# Altium schematic sheet Parallel LED Strip Buck Converter.SchDoc
size A; SheetNumber: 3; SheetTotal: 19
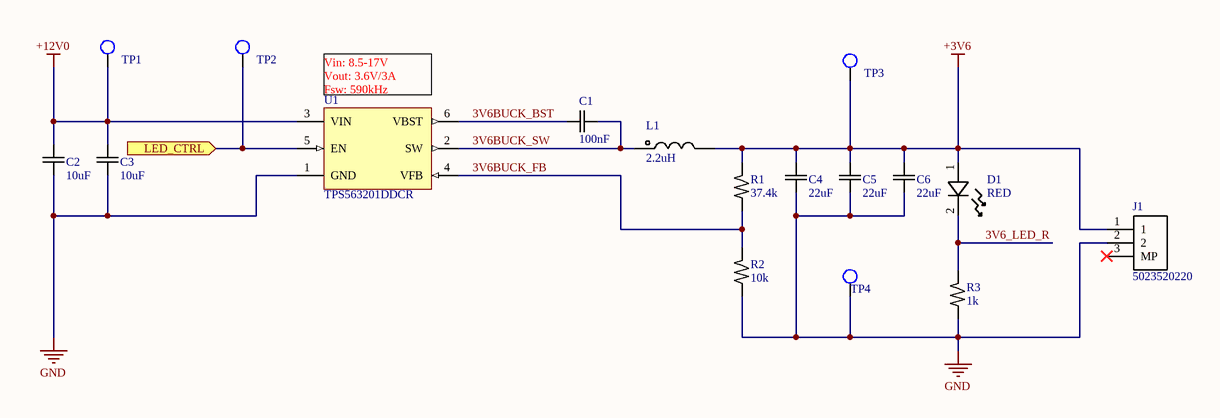
[diagram p0: Parallel LED Strip Buck Converter.SchDoc]

## Parts
C1  100nF  [C0603]
C2  10uF  [C1206]
C3  10uF  [C1206]
C4  22uF  [C1206]
C5  22uF  [C1206]
C6  22uF  [C1206]
D1  RED  [LED0805 RED]
J1  5023520220  [5600200220]
L1  2.2uH  [Coil 7.2x6.6]
R1  37.4k  [R0603]
R2  10k  [R0603]
R3  1k  [R0603]
TP1  TestPoint  [TESTPOINT_SMD_1.27MM]  (value not drawn)  (no BOM)
TP2  TestPoint  [TESTPOINT_SMD_1.27MM]  (value not drawn)  (no BOM)
TP3  TestPoint  [TESTPOINT_SMD_1.27MM]  (value not drawn)  (no BOM)
TP4  TestPoint  [TESTPOINT_SMD_1.27MM]  (value not drawn)  (no BOM)
U1  TPS563201DDCR  [SOT23-6]

## Ports
LED_CTRL (in)

## Nets
+3V6: C4.1 C5.1 C6.1 D1.1 J1.1 L1.2 R1.2 TP3.1
+12V0: C2.2 C3.2 TP1.1 U1.3(VIN)
GND: C2.1 C3.1 C4.2 C5.2 C6.2 J1.2 R2.1 R3.1 TP4.1 U1.1(GND)
3V6_LED_R: D1.2 R3.2
3V6BUCK_BST: C1.1 U1.6(VBST)
3V6BUCK_FB: R1.1 R2.2 U1.4(VFB)
3V6BUCK_SW: C1.2 L1.1 U1.2(SW)
LED_CTRL: TP2.1 U1.5(EN) ; port LED_CTRL

Not connected (* = marked no-connect by the designer): J1 3(MP)*

## Notes on the sheet
- (near U1) Vin: 8.5-17V
  Vout: 3.6V/3A
  Fsw: 590kHz
- Project:
- Sheet Title:
- Size
- Date:
- A
- Sheet Number:
- Sheet Total:
- Revision:
- Time:
- Author:

## Library data of the parts
C1 = Cap_cer: CAP CER 100nF 50V X7R 0603; MF: HRE; MP: CGA0603X7R104K500JT; ComponentLink1Description: Datasheet; ComponentLink1URL: https://www.lcsc.com/datasheet/C6119867.pdf; ComponentLink2Description: Supplier1; ComponentLink2URL: https://www.lcsc.com/product-detail/C6119867.html
C2 C3 = Cap_cer: CAP CER 10uF 25V X7R 1206; MF: SAMWHA; MP: CS3216X7R106K250NRI; ComponentLink1Description: Datasheet; ComponentLink1URL: https://www.lcsc.com/datasheet/C513767.pdf; ComponentLink2Description: Supplier1; ComponentLink2URL: https://www.lcsc.com/product-detail/C513767.html
C4-C6 = Cap_cer: CAP CER 22uF 10V X7R 1206; MF: CCTC; MP: TCC1206X7R226K100HT; ComponentLink1Description: Datasheet; ComponentLink1URL: https://www.lcsc.com/datasheet/C20416445.pdf; ComponentLink2Description: Supplier1; ComponentLink2URL: https://www.lcsc.com/product-detail/C20416445.html
D1 = LED: LED RED WATER CLEAR 0805 SMD; MF: XINGLIGHT; MP: XL-TD2012SURC; ComponentLink1Description: Datasheet; ComponentLink1URL: https://www.lcsc.com/datasheet/C5349939.pdf; ComponentLink2Description: Supplier1; ComponentLink2URL: https://www.lcsc.com/product-detail/C5349939.html
J1 = 5023520202: White 2P 1x2P Tin 2mm Copper Alloy 125V 2 3A 1 Surface Mount,Vertical SMD,P=2mm Headers, Male Pins ROHS; MF: MOLEX; MP: 5600200220; ComponentLink1Description: Supplier 1; ComponentLink1URL: https://www.lcsc.com/product-detail/C114092.html?s_z=n_5600200220; ComponentLink2Description: Datasheet; ComponentLink2URL: https://www.molex.com/content/dam/molex/molex-dot-com/products/automated/en-us/salesdrawingpdf/560/560020/5600200220_sd.pdf?inline\
L1 = Coil: FIXED IND 2.2uH 9.5A 11.2mΩ SMD,7.2x6.6mm; MF: SHOU HAN; MP: CYA0650-2.2UH; ComponentLink1Description: Datasheet; ComponentLink1URL: https://www.lcsc.com/datasheet/C5189752.pdf; ComponentLink2Description: Supplier1; ComponentLink2URL: https://www.lcsc.com/product-detail/C5189752.html
R1 = Res: RES 37.4kΩ ±1% 100mW 0603; MF: FOJAN; MP: FRC0603F3742TS; ComponentLink1Description: Datasheet; ComponentLink1URL: https://www.lcsc.com/datasheet/C2933211.pdf; ComponentLink2Description: Supplier1; ComponentLink2URL: https://www.lcsc.com/product-detail/C2933211.html
R2 = Res: RES 10kΩ ±1% 100mW 0603; MF: FOJAN; MP: FRC0603F1002TS; ComponentLink1Description: Datasheet; ComponentLink1URL: https://www.lcsc.com/datasheet/C2906982.pdf; ComponentLink2Description: Supplier1; ComponentLink2URL: https://www.lcsc.com/product-detail/C2906982.html
R3 = Res: RES 1kΩ ±5% 100mW 0603; MF: VO; MP: SCR0603J1K; ComponentLink1Description: Datasheet; ComponentLink1URL: https://www.lcsc.com/datasheet/C3017736.pdf; ComponentLink2Description: Supplier1; ComponentLink2URL: https://www.lcsc.com/product-detail/C3017736.html
U1 = TPS563201DDCR: 580kHz 3A Buck Adjustable 768mV~7V 1 SOT-23-THIN-6 Voltage Regulators - DC DC Switching Regulators ROHS; MF: Texas Instruments; ComponentLink1Description: Datasheet; ComponentLink1URL: https://www.lcsc.com/datasheet/C116592.pdf; ComponentLink2Description: Supplier1; ComponentLink2URL: https://www.lcsc.com/product-detail/C116592.html; MP: TPS563201DDCR